# Altium schematic sheet special-channel-selection.SchDoc: Special Channel Selection
size A4; DocumentNumber: 8; Revision: 2; SheetNumber: 8; SheetTotal: 13
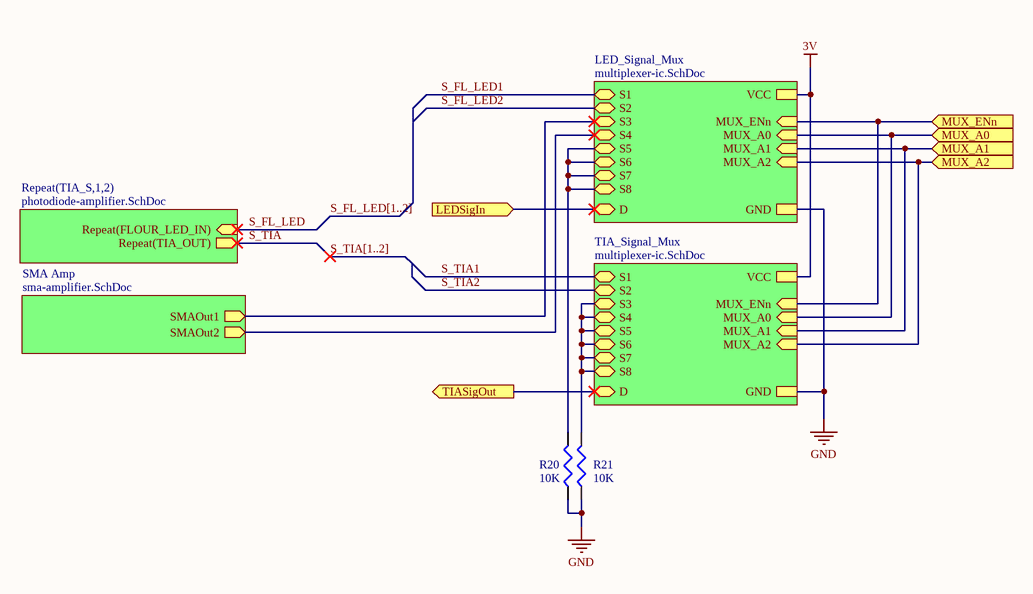
[diagram p0: special-channel-selection.SchDoc]

## Parts
R20  10K  [0402]
R21  10K  [0402]

## Sub-sheets
LED_Signal_Mux = multiplexer-ic.SchDoc: S7 (bidir), D (bidir), S3 (bidir), S1 (bidir), S4 (bidir), MUX_ENn (in), S2 (bidir), VCC, GND, S8 (bidir), S6 (bidir), MUX_A1 (in), MUX_A0 (in), S5 (bidir), MUX_A2 (in)
Repeat(TIA_S,1,2) = photodiode-amplifier.SchDoc: Repeat(TIA_OUT) (out), Repeat(FLOUR_LED_IN) (in)
SMA Amp = sma-amplifier.SchDoc: SMAOut1 (out), SMAOut2 (out)
TIA_Signal_Mux = multiplexer-ic.SchDoc: S7 (bidir), D (bidir), S3 (bidir), S1 (bidir), S4 (bidir), MUX_ENn (in), S2 (bidir), VCC, GND, S8 (bidir), S6 (bidir), MUX_A1 (in), MUX_A0 (in), S5 (bidir), MUX_A2 (in)

## Ports
LEDSigIn (in), MUX_A0 (in), MUX_A1 (in), MUX_A2 (in), MUX_ENn (in), TIASigOut (out)

## Nets
3V: sheet TIA_Signal_Mux/VCC, sheet LED_Signal_Mux/VCC
GND: R20.1 R21.1 ; sheet TIA_Signal_Mux/GND, sheet LED_Signal_Mux/GND
LEDSigIn: port LEDSigIn, sheet LED_Signal_Mux/D
MUX_A0: port MUX_A0, sheet TIA_Signal_Mux/MUX_A0, sheet LED_Signal_Mux/MUX_A0
MUX_A1: port MUX_A1, sheet TIA_Signal_Mux/MUX_A1, sheet LED_Signal_Mux/MUX_A1
MUX_A2: port MUX_A2, sheet TIA_Signal_Mux/MUX_A2, sheet LED_Signal_Mux/MUX_A2
MUX_ENn: port MUX_ENn, sheet TIA_Signal_Mux/MUX_ENn, sheet LED_Signal_Mux/MUX_ENn
S_FL_LED: sheet Repeat(TIA_S,1,2)/Repeat(FLOUR_LED_IN)
S_FL_LED1: sheet LED_Signal_Mux/S1
S_FL_LED2: sheet LED_Signal_Mux/S2
S_TIA: sheet Repeat(TIA_S,1,2)/Repeat(TIA_OUT)
S_TIA1: sheet TIA_Signal_Mux/S1
S_TIA2: sheet TIA_Signal_Mux/S2
TIASigOut: port TIASigOut, sheet TIA_Signal_Mux/D
NetR20_2: R20.2 ; sheet LED_Signal_Mux/S7, sheet LED_Signal_Mux/S8, sheet LED_Signal_Mux/S6, sheet LED_Signal_Mux/S5
NetR21_2: R21.2 ; sheet TIA_Signal_Mux/S7, sheet TIA_Signal_Mux/S3, sheet TIA_Signal_Mux/S4, sheet TIA_Signal_Mux/S8, sheet TIA_Signal_Mux/S6, sheet TIA_Signal_Mux/S5
(unnamed): sheet LED_Signal_Mux/S3, sheet SMA Amp/SMAOut1
(unnamed): sheet LED_Signal_Mux/S4, sheet SMA Amp/SMAOut2

## Buses and harness runs
bus S_FL_LED[1..2]
bus S_TIA[1..2]

## Library data of the parts
R20 R21 = Res3: Resistor; Published: 8-Jun-2000; LatestRevisionDate: 29-May-2009; LatestRevisionNote: IPC-7351 Footprint Added.; PackageReference: J1-0603; Publisher: Altium Limited; PackageDescription: Chip Resistor; Value: 10K; Supplier 1: Digi-Key